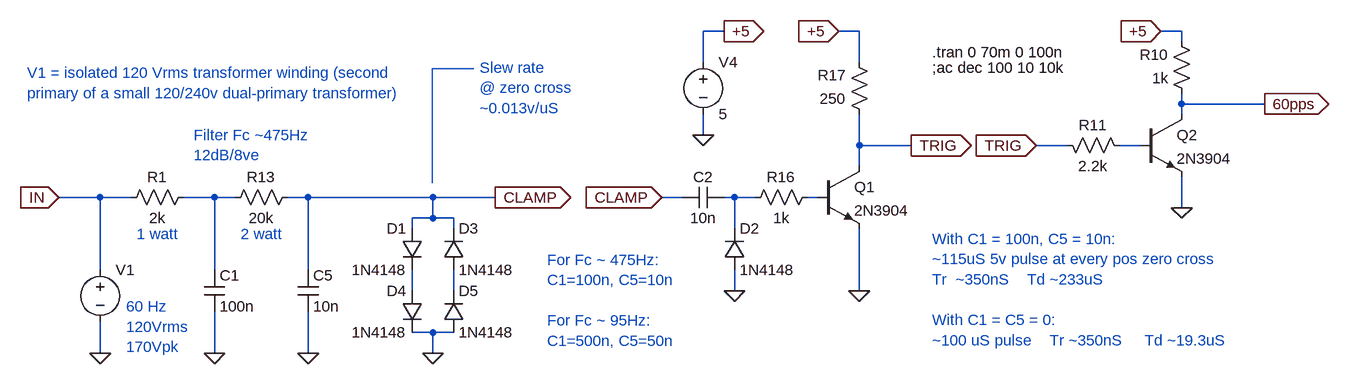
[diagram p0: schematic 60_Hz_zero_cross_detector_simple_120v.asc]
60_Hz_zero_cross_detector_simple_120v.asc, the LTspice schematic file:
Version 4
SHEET 1 2852 980
WIRE 720 -208 688 -208
WIRE 928 -208 896 -208
WIRE 1424 -208 1392 -208
WIRE 1424 -192 1424 -208
WIRE 688 -160 688 -208
WIRE 928 -160 928 -208
WIRE 1424 -96 1424 -112
WIRE 1552 -96 1424 -96
WIRE 1424 -80 1424 -96
WIRE 688 -48 688 -80
WIRE 928 -32 928 -80
WIRE 1008 -32 928 -32
WIRE 1248 -32 1200 -32
WIRE 1360 -32 1328 -32
WIRE 928 0 928 -32
WIRE -240 48 -304 48
WIRE -192 48 -240 48
WIRE -64 48 -112 48
WIRE -32 48 -64 48
WIRE 80 48 48 48
WIRE 272 48 80 48
WIRE 368 48 272 48
WIRE 656 48 624 48
WIRE 736 48 720 48
WIRE 768 48 736 48
WIRE 864 48 848 48
WIRE 1424 64 1424 16
WIRE 272 80 272 48
WIRE 272 80 240 80
WIRE 304 80 272 80
WIRE 240 96 240 80
WIRE 304 96 304 80
WIRE 736 96 736 48
WIRE -240 160 -240 48
WIRE -64 160 -64 48
WIRE 80 160 80 48
WIRE 240 192 240 160
WIRE 304 192 304 160
WIRE 736 192 736 160
WIRE 928 192 928 96
WIRE 272 256 240 256
WIRE 304 256 272 256
WIRE -240 288 -240 240
WIRE -64 288 -64 224
WIRE 80 288 80 224
WIRE 272 288 272 256
FLAG -240 288 0
FLAG -304 48 IN
IOPIN -304 48 In
FLAG -64 288 0
FLAG 272 288 0
FLAG 688 -48 0
FLAG 720 -208 +5
IOPIN 720 -208 Out
FLAG 624 48 CLAMP
IOPIN 624 48 In
FLAG 368 48 CLAMP
IOPIN 368 48 Out
FLAG 1552 -96 60pps
IOPIN 1552 -96 Out
FLAG 80 288 0
FLAG 928 192 0
FLAG 896 -208 +5
IOPIN 896 -208 In
FLAG 1008 -32 TRIG
IOPIN 1008 -32 Out
FLAG 1424 64 0
FLAG 1392 -208 +5
IOPIN 1392 -208 In
FLAG 1200 -32 TRIG
IOPIN 1200 -32 In
FLAG 736 192 0
SYMBOL voltage -240 144 R0
WINDOW 39 0 0 Left 2
WINDOW 3 24 96 Invisible 2
SYMATTR Value SINE(0 170 60)
SYMATTR Value2 AC 1
SYMATTR InstName V1
SYMBOL res -208 64 R270
WINDOW 0 32 56 VTop 2
WINDOW 3 0 56 VBottom 2
SYMATTR InstName R1
SYMATTR Value 2k
SYMBOL diode 256 96 M0
SYMATTR InstName D1
SYMATTR Value 1N4148
SYMBOL diode 288 160 M180
WINDOW 0 24 64 Left 2
WINDOW 3 24 0 Left 2
SYMATTR InstName D3
SYMATTR Value 1N4148
SYMBOL cap -80 160 R0
SYMATTR InstName C1
SYMATTR Value 100n
SYMBOL voltage 688 -176 R0
WINDOW 123 0 0 Left 2
WINDOW 39 0 0 Left 2
SYMATTR InstName V4
SYMATTR Value 5
SYMBOL npn 864 0 R0
SYMATTR InstName Q1
SYMATTR Value 2N3904
SYMBOL res -48 64 R270
WINDOW 0 32 56 VTop 2
WINDOW 3 0 56 VBottom 2
SYMATTR InstName R13
SYMATTR Value 20k
SYMBOL cap 64 160 R0
SYMATTR InstName C5
SYMATTR Value 10n
SYMBOL res 752 64 R270
WINDOW 0 32 56 VTop 2
WINDOW 3 0 56 VBottom 2
SYMATTR InstName R16
SYMATTR Value 1k
SYMBOL res 944 -64 R180
WINDOW 0 36 76 Left 2
WINDOW 3 36 40 Left 2
SYMATTR InstName R17
SYMATTR Value 250
SYMBOL npn 1360 -80 R0
SYMATTR InstName Q2
SYMATTR Value 2N3904
SYMBOL res 1440 -96 R180
WINDOW 0 36 76 Left 2
WINDOW 3 36 40 Left 2
SYMATTR InstName R10
SYMATTR Value 1k
SYMBOL res 1344 -16 M270
WINDOW 0 32 56 VTop 2
WINDOW 3 0 56 VBottom 2
SYMATTR InstName R11
SYMATTR Value 2.2k
SYMBOL diode 256 192 M0
SYMATTR InstName D4
SYMATTR Value 1N4148
SYMBOL diode 288 256 M180
WINDOW 0 24 64 Left 2
WINDOW 3 24 0 Left 2
SYMATTR InstName D5
SYMATTR Value 1N4148
SYMBOL cap 656 64 R270
WINDOW 0 32 32 VTop 2
WINDOW 3 0 32 VBottom 2
SYMATTR InstName C2
SYMATTR Value 10n
SYMBOL diode 720 160 M180
WINDOW 0 24 64 Left 2
WINDOW 3 24 0 Left 2
SYMATTR InstName D2
SYMATTR Value 1N4148
TEXT -352 -144 Left 2 ;V1 = isolated 120 Vrms transformer winding (second \nprimary of a small 120/240v dual-primary transformer)
TEXT 1040 -176 Left 2 !.tran 0 70m 0 100n
TEXT 344 -152 Left 2 ;Slew rate \n@ zero cross \n~0.013v/uS
TEXT 1040 112 Left 2 ;With C1 = 100n, C5 = 10n:\n~115uS 5v pulse at every pos zero cross\nTr  ~350nS    Td ~233uS\n \nWith C1 = C5 = 0:\n~100 uS pulse    Tr ~350nS     Td ~19.3uS
TEXT 1040 -152 Left 2 !;ac dec 100 10 10k
TEXT -184 104 Left 2 ;1 watt
TEXT -24 104 Left 2 ;2 watt
TEXT -96 -48 Left 2 ;Filter Fc ~475Hz\n12dB/8ve
TEXT -200 216 Left 2 ;60 Hz\n120Vrms\n170Vpk
TEXT 448 144 Left 2 ;For Fc ~ 475Hz:\nC1=100n, C5=10n\n \nFor Fc ~ 95Hz:\nC1=500n, C5=50n
LINE Normal 335 -150 271 -150
LINE Normal 271 26 271 -150

The netlist it stands for:
* 60_Hz_zero_cross_detector_simple_120v.asc
V1 IN 0 SINE(0 170 60) AC 1
R1 IN N002 2k
D1 CLAMP N005 1N4148
D3 N006 CLAMP 1N4148
C1 N002 0 100n
V4 +5 0 5
Q1 TRIG N004 0 0 2N3904
R13 N002 CLAMP 20k
C5 CLAMP 0 10n
R16 N003 N004 1k
R17 TRIG +5 250
Q2 60pps N001 0 0 2N3904
R10 60pps +5 1k
R11 N001 TRIG 2.2k
D4 N005 0 1N4148
D5 0 N006 1N4148
C2 CLAMP N003 10n
D2 0 N003 1N4148
.model D D
.lib standard.dio
.model NPN NPN
.model PNP PNP
.lib standard.bjt
* V1 = isolated 120 Vrms transformer winding (second
* primary of a small 120/240v dual-primary transformer)
.tran 0 70m 0 100n
* Slew rate
* @ zero cross
* ~0.013v/uS
* With C1 = 100n, C5 = 10n:
* ~115uS 5v pulse at every pos zero cross
* Tr  ~350nS    Td ~233uS
* With C1 = C5 = 0:
* ~100 uS pulse    Tr ~350nS     Td ~19.3uS
;ac dec 100 10 10k
* 1 watt
* 2 watt
* Filter Fc ~475Hz
* 12dB/8ve
* 60 Hz
* 120Vrms
* 170Vpk
* For Fc ~ 475Hz:
* C1=100n, C5=10n
* For Fc ~ 95Hz:
* C1=500n, C5=50n
.backanno
.end